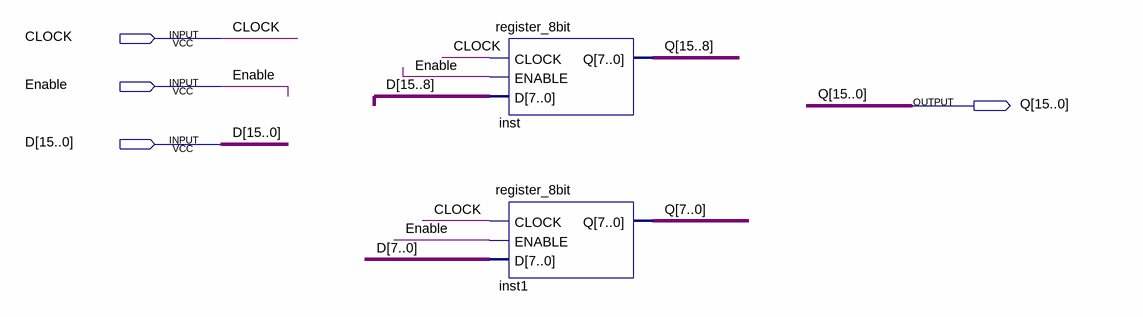
[diagram p0: schematic sheet]
// Quartus schematic Register_8bit_enable.bdf as structural Verilog: 2 symbols, 4 pins
module Register_8bit_enable (
  input  CLOCK,
  input  Enable,
  input  [15:0] D,
  output [15:0] Q
);

  register_8bit inst (.CLOCK(CLOCK), .ENABLE(Enable), .D(D[15:8]), .Q(Q[15:8]));
  register_8bit inst1 (.CLOCK(CLOCK), .ENABLE(Enable), .D(D[7:0]), .Q(Q[7:0]));
endmodule
